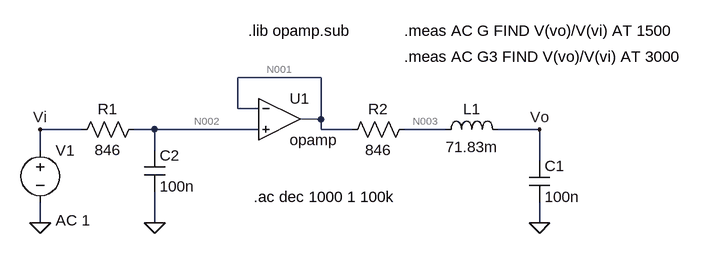
[diagram p0: schematic simulacion.asc]
simulacion.asc, the LTspice schematic file:
Version 4
SHEET 1 880 680
WIRE 176 96 48 96
WIRE 48 144 48 96
WIRE 80 144 48 144
WIRE 176 160 176 96
WIRE 176 160 144 160
WIRE -192 176 -256 176
WIRE -80 176 -112 176
WIRE 80 176 -80 176
WIRE 176 176 176 160
WIRE 224 176 176 176
WIRE 368 176 304 176
WIRE 512 176 448 176
WIRE -256 208 -256 176
WIRE -80 208 -80 176
WIRE 512 224 512 176
WIRE -256 320 -256 288
WIRE -80 320 -80 272
WIRE 512 320 512 288
FLAG 512 320 0
FLAG -80 320 0
FLAG -256 320 0
FLAG 512 176 Vo
FLAG -256 176 Vi
SYMBOL OpAmps\\opamp 112 96 R0
SYMATTR InstName U1
SYMBOL ind 352 192 R270
WINDOW 0 32 56 VTop 2
WINDOW 3 5 56 VBottom 2
SYMATTR InstName L1
SYMATTR Value 71.83m
SYMBOL cap 496 224 R0
SYMATTR InstName C1
SYMATTR Value 100n
SYMBOL res -96 160 R90
WINDOW 0 0 56 VBottom 2
WINDOW 3 32 56 VTop 2
SYMATTR InstName R1
SYMATTR Value 846
SYMBOL cap -96 208 R0
SYMATTR InstName C2
SYMATTR Value 100n
SYMBOL voltage -256 192 R0
WINDOW 123 24 124 Left 2
WINDOW 39 0 0 Left 0
SYMATTR Value2 AC 1
SYMATTR InstName V1
SYMATTR Value ""
SYMBOL res 320 160 R90
WINDOW 0 0 56 VBottom 2
WINDOW 3 32 56 VTop 2
SYMATTR InstName R2
SYMATTR Value 846
TEXT 64 24 Left 2 !.lib opamp.sub
TEXT 72 280 Left 2 !.ac dec 1000 1 100k
TEXT 304 24 Left 2 !.meas AC G FIND V(vo)/V(vi) AT 1500
TEXT 304 64 Left 2 !.meas AC G3 FIND V(vo)/V(vi) AT 3000

The netlist it stands for:
* simulacion.asc
XU1 N001 N002 N001 opamp Aol=100K GBW=10Meg  ; pins invin noninvin out
L1 N003 Vo 71.83m
C1 Vo 0 100n
R1 N002 Vi 846
C2 N002 0 100n
V1 Vi 0 AC 1
R2 N003 N001 846
.lib opamp.sub
.ac dec 1000 1 100k
.meas AC G FIND V(vo)/V(vi) AT 1500
.meas AC G3 FIND V(vo)/V(vi) AT 3000
.backanno
.end

* Results of the author's LTspice run, read from the files saved beside the schematic
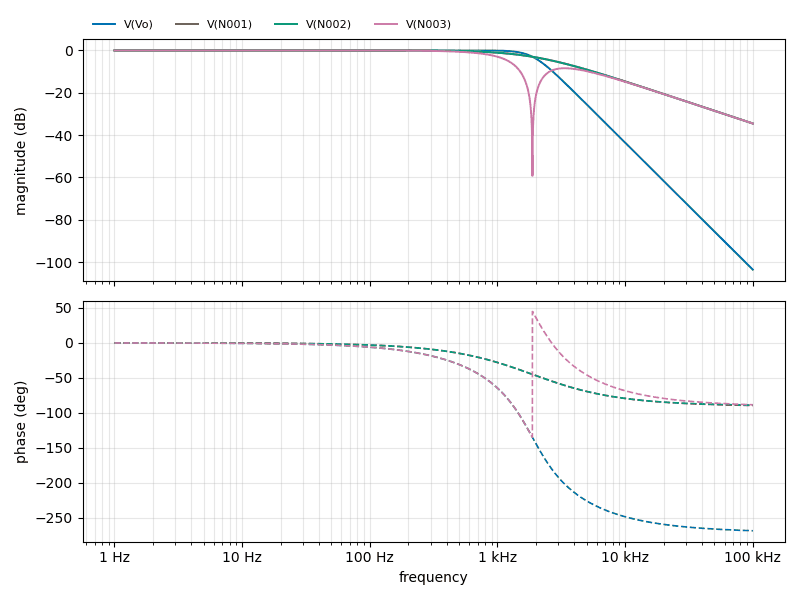
[diagram p1: AC Analysis of simulacion.asc, plotted from the saved traces]
* AC Analysis, 1 run:
*   V(Vo): -0.00 dB at 1 Hz, -103.56 dB at 100 kHz, peak 0.00 dB at 415.9 Hz, 3 dB below the peak at 1.881 kHz
*   V(N001): -0.00 dB at 1 Hz, -34.51 dB at 100 kHz, peak -0.00 dB at 1 Hz, 3 dB below the peak at 1.881 kHz
*   V(N002): -0.00 dB at 1 Hz, -34.51 dB at 100 kHz, peak -0.00 dB at 1 Hz, 3 dB below the peak at 1.881 kHz
*   V(N003): -0.00 dB at 1 Hz, -34.51 dB at 100 kHz, peak -0.00 dB at 1 Hz, 3 dB below the peak at 1.003 kHz
* From the log:
*   g: v(vo)/v(vi)=(-0.983858dB,-104.159°) at 1500
*   g3: v(vo)/v(vi)=(-12.4417dB,167.848°) at 3000